# EasyEDA schematic schematics_easyeda.json
TITLE: Binary Adder (ID220 Homework 4); REV: 2.0; Date: 2022-08-12; Sheet: 1/1; Drawn By: Andrea; Company: Andrea Bianchi
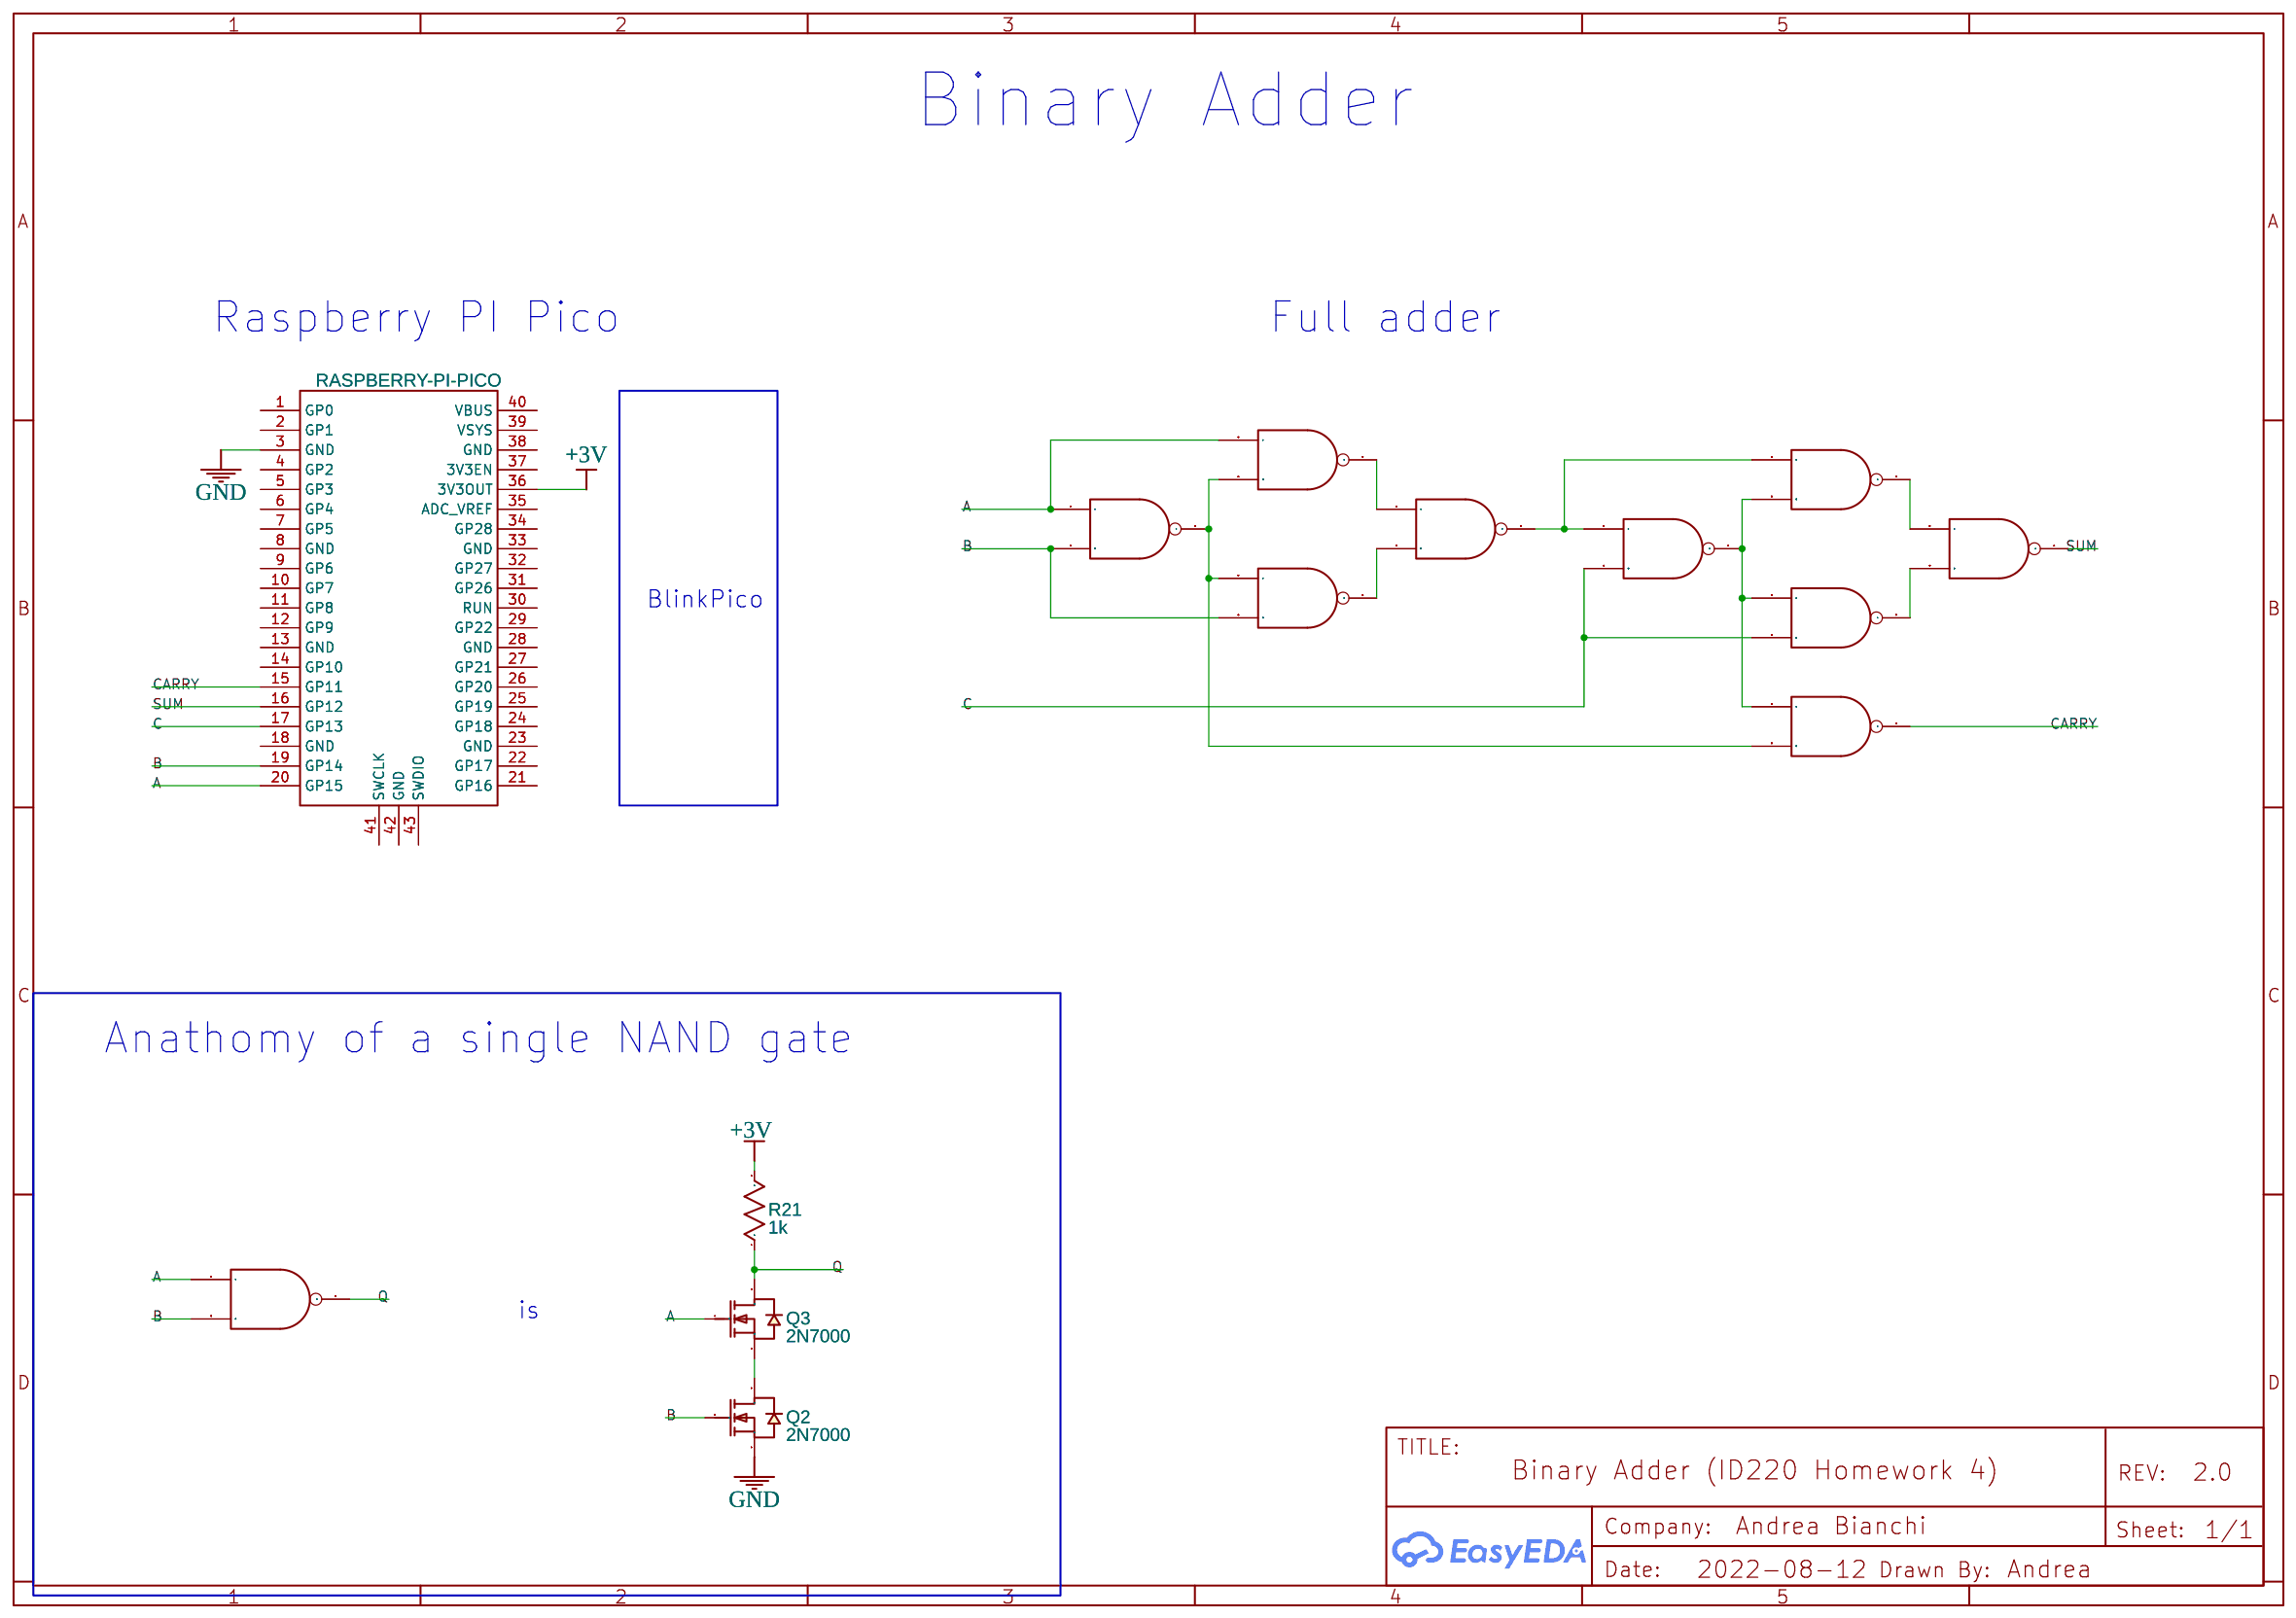
[diagram p0: schematic sheet]

## Parts
NAND1  NO  [SOIC14N]
NAND2  NO  [SOIC14N]
NAND3  NO  [SOIC14N]
NAND4  NO  [SOIC14N]
NAND5  NO  [SOIC14N]
NAND6  NO  [SOIC14N]
NAND7  NO  [SOIC14N]
NAND8  NO  [SOIC14N]
NAND9  NO  [SOIC14N]
NAND10  NO  [SOIC14N]
Q2  2N7000  [SOT-23_L2.9-W1.3-P0.95-LS2.4-BR]
Q3  2N7000  [SOT-23_L2.9-W1.3-P0.95-LS2.4-BR]
R21  1k  [R0603]
U4  RASPBERRY-PI-PICO  [RASPBERRY-PI-PICO]

## Library data of the parts
NAND1-NAND10 = -: catid: 20; sourceId: qsYgysK2j; Manufacturer Part: ?
Q2 Q3 = 2N7002: Supplier: LCSC; Manufacturer: Nexperia; Manufacturer Part: 2N7002,215; image: //image.lceda.cn/szlcsc/C65189.jpg; Supplier Part: C65189; Paste Type: expand; Contributor: LCEDA_Lib; Package Display: No
R21 = R_0603_US: Contributor: LCEDA_Lib
U4 = RASPBERRY-PI-PICO: Contributor: kazhida

## Nets
+3V: R21.2 U4.36(3V3OUT)
GND: Q2.2(S) U4.3(GND)
A: NAND1.12(A) NAND2.12(A) NAND10.12(A) Q3.1(G) U4.20(GP15)
B: NAND1.13(B) NAND3.13(B) NAND10.13(B) Q2.1(G) U4.19(GP14)
C: NAND6.13(B) NAND8.13(B) U4.17(GP13)
CARRY: NAND9.11(Y) U4.15(GP11)
Q: NAND10.11(Y) Q3.3(D) R21.1
SUM: NAND5.11(Y) U4.16(GP12)
Net-(NAND1-11): NAND1.11(Y) NAND2.13(B) NAND3.12(A) NAND9.13(B)
Net-(NAND2-11): NAND2.11(Y) NAND4.12(A)
Net-(NAND3-11): NAND3.11(Y) NAND4.13(B)
Net-(NAND4-11): NAND4.11(Y) NAND7.12(A) NAND8.12(A)
Net-(NAND5-12): NAND5.12(A) NAND7.11(Y)
Net-(NAND5-13): NAND5.13(B) NAND6.11(Y)
Net-(NAND6-12): NAND6.12(A) NAND7.13(B) NAND8.11(Y) NAND9.12(A)
Net-(Q2-3): Q2.3(D) Q3.2(S)

Not connected (* = marked no-connect by the designer): U4 1(GP0) 2(GP1) 4(GP2) 5(GP3) 6(GP4) 7(GP5) 8(GND) 9(GP6) 10(GP7) 11(GP8) 12(GP9) 13(GND) 14(GP10) 18(GND) 21(GP16) 22(GP17) 23(GND) 24(GP18) 25(GP19) 26(GP20) 27(GP21) 28(GND) 29(GP22) 30(RUN) 31(GP26) 32(GP27) 33(GND) 34(GP28) 35(ADC_VREF) 37(3V3EN) 38(GND) 39(VSYS) 40(VBUS) 41(SWCLK) 42(GND) 43(SWDIO)

## Notes on the sheet
- Binary Adder
- Raspberry PI Pico
- Full adder
- BlinkPico
- Anathomy of a single NAND gate
- is
